# Altium schematic sheet Node.SchDoc
size A; SheetNumber: 1; SheetTotal: 2
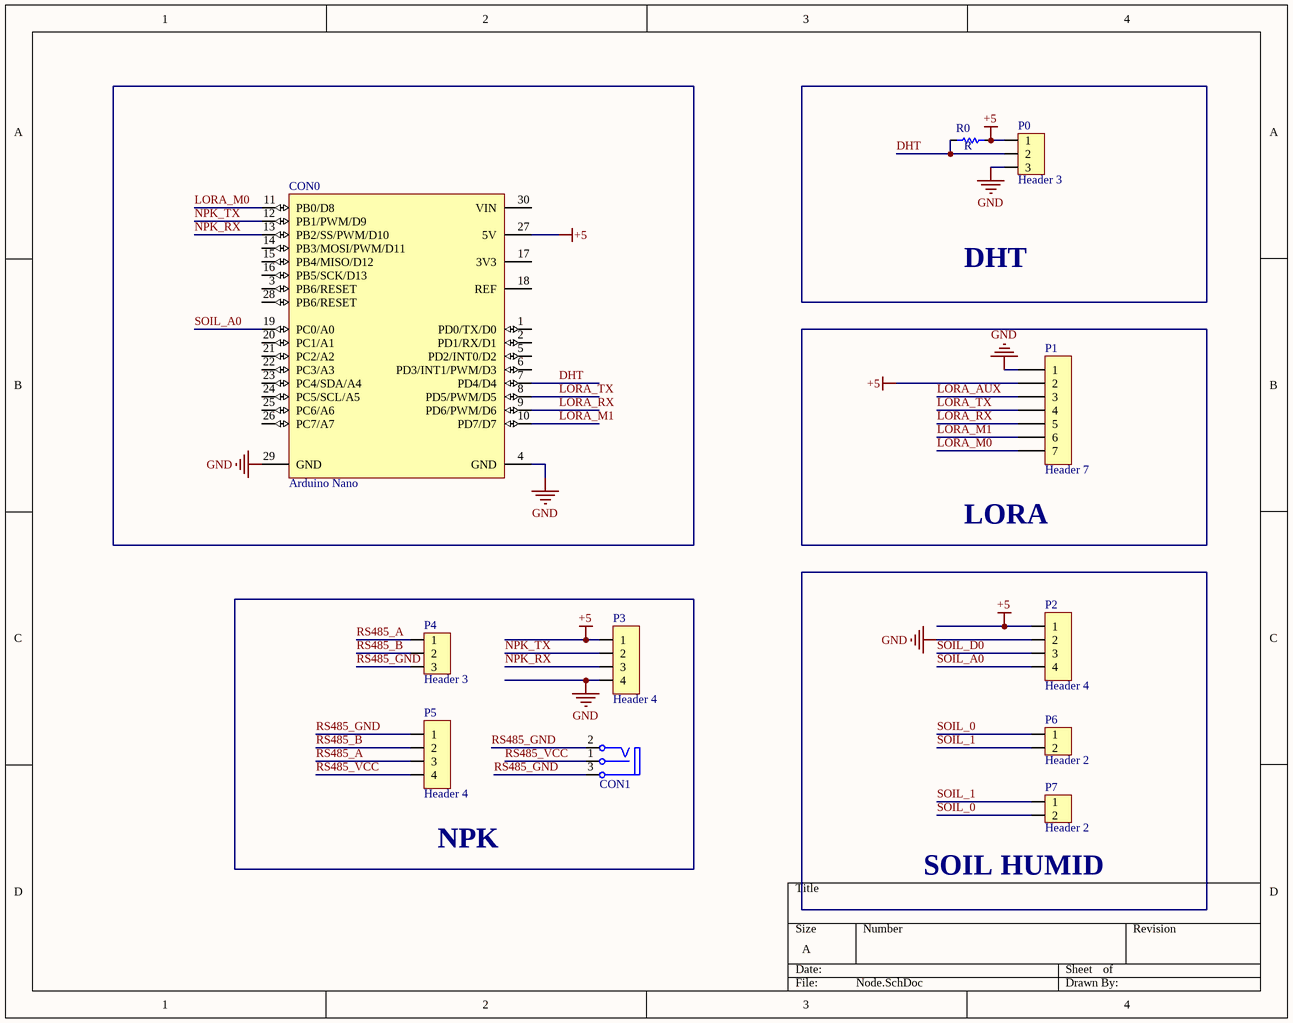
[diagram p0: Node.SchDoc]

## Parts
CON0  Arduino Nano  [Arduino Nano 15x2]
CON1  CON DC PWR  [CONN/DC/PWR/5.0MM]  (value not drawn)
P0  Header 3  [XH2.54-3P]
P1  Header 7  [Header 7]
P2  Header 4  [Header 4]
P3  Header 4  [Header 4]
P4  Header 3  [SH152-5.08-3P]
P5  Header 4  [HDR DOMINO 4]
P6  Header 2  [Header 2]
P7  Header 2  [XH2.54-2P]
R0  R  [R 1206 (3216)]

## Nets
+5: CON0.27(5V) P0.1 P1.2 P2.1 P3.1 R0.2
GND: CON0.4(GND) CON0.29(GND) P0.3 P1.1 P2.2 P3.4
DHT: CON0.7(PD4/D4) P0.2 R0.1
LORA_AUX: P1.3
LORA_M0: CON0.11(PB0/D8) P1.7
LORA_M1: CON0.10(PD7/D7) P1.6
LORA_RX: CON0.9(PD6/PWM/D6) P1.5
LORA_TX: CON0.8(PD5/PWM/D5) P1.4
NPK_RX: CON0.13(PB2/SS/PWM/D10) P3.3
NPK_TX: CON0.12(PB1/PWM/D9) P3.2
RS485_A: P4.1 P5.3
RS485_B: P4.2 P5.2
RS485_GND: CON1.2(T) CON1.3(TN) P4.3 P5.1
RS485_VCC: CON1.1(S) P5.4
SOIL_0: P6.1 P7.2
SOIL_1: P6.2 P7.1
SOIL_A0: CON0.19(PC0/A0) P2.4
SOIL_D0: P2.3

Not connected (* = marked no-connect by the designer): CON0 1(PD0/TX/D0) 2(PD1/RX/D1) 3(PB6/RESET) 5(PD2/INT0/D2) 6(PD3/INT1/PWM/D3) 14(PB3/MOSI/PWM/D11) 15(PB4/MISO/D12) 16(PB5/SCK/D13) 17(3V3) 18(REF) 20(PC1/A1) 21(PC2/A2) 22(PC3/A3) 23(PC4/SDA/A4) 24(PC5/SCL/A5) 25(PC6/A6) 26(PC7/A7) 28(PB6/RESET) 30(VIN)

## Notes on the sheet
- DHT
- (near P1) LORA
- (near P5) NPK
- (near P7) SOIL HUMID

## Library data of the parts
CON0 = Arduino Nano: Arduino Nano 15X2
CON1 = CON DC PWR: DC input connector
P0 P4 = Header 3: Header, 3-Pin
P1 = Header 7: Header, 7-Pin; LatestRevisionDate: 17-Jul-2002; LatestRevisionNote: Re-released for DXP Platform.; Publisher: Altium Limited
P2 P3 P5 = Header 4: Header, 4-Pin
P6 P7 = Header 2: Header, 2-Pin; LatestRevisionDate: 17-Jul-2002; LatestRevisionNote: Re-released for DXP Platform.; Publisher: Altium Limited
R0 = Resistor: Published: 8-Jun-2000; LatestRevisionDate: 17-Jul-2002; LatestRevisionNote: Re-released for DXP Platform.; PackageReference: AXIAL-0.3; Publisher: Altium Limited